# EAGLE design DC_Sensor_ESP8266_ADC_NC_11b (EAGLE 7.5.0)
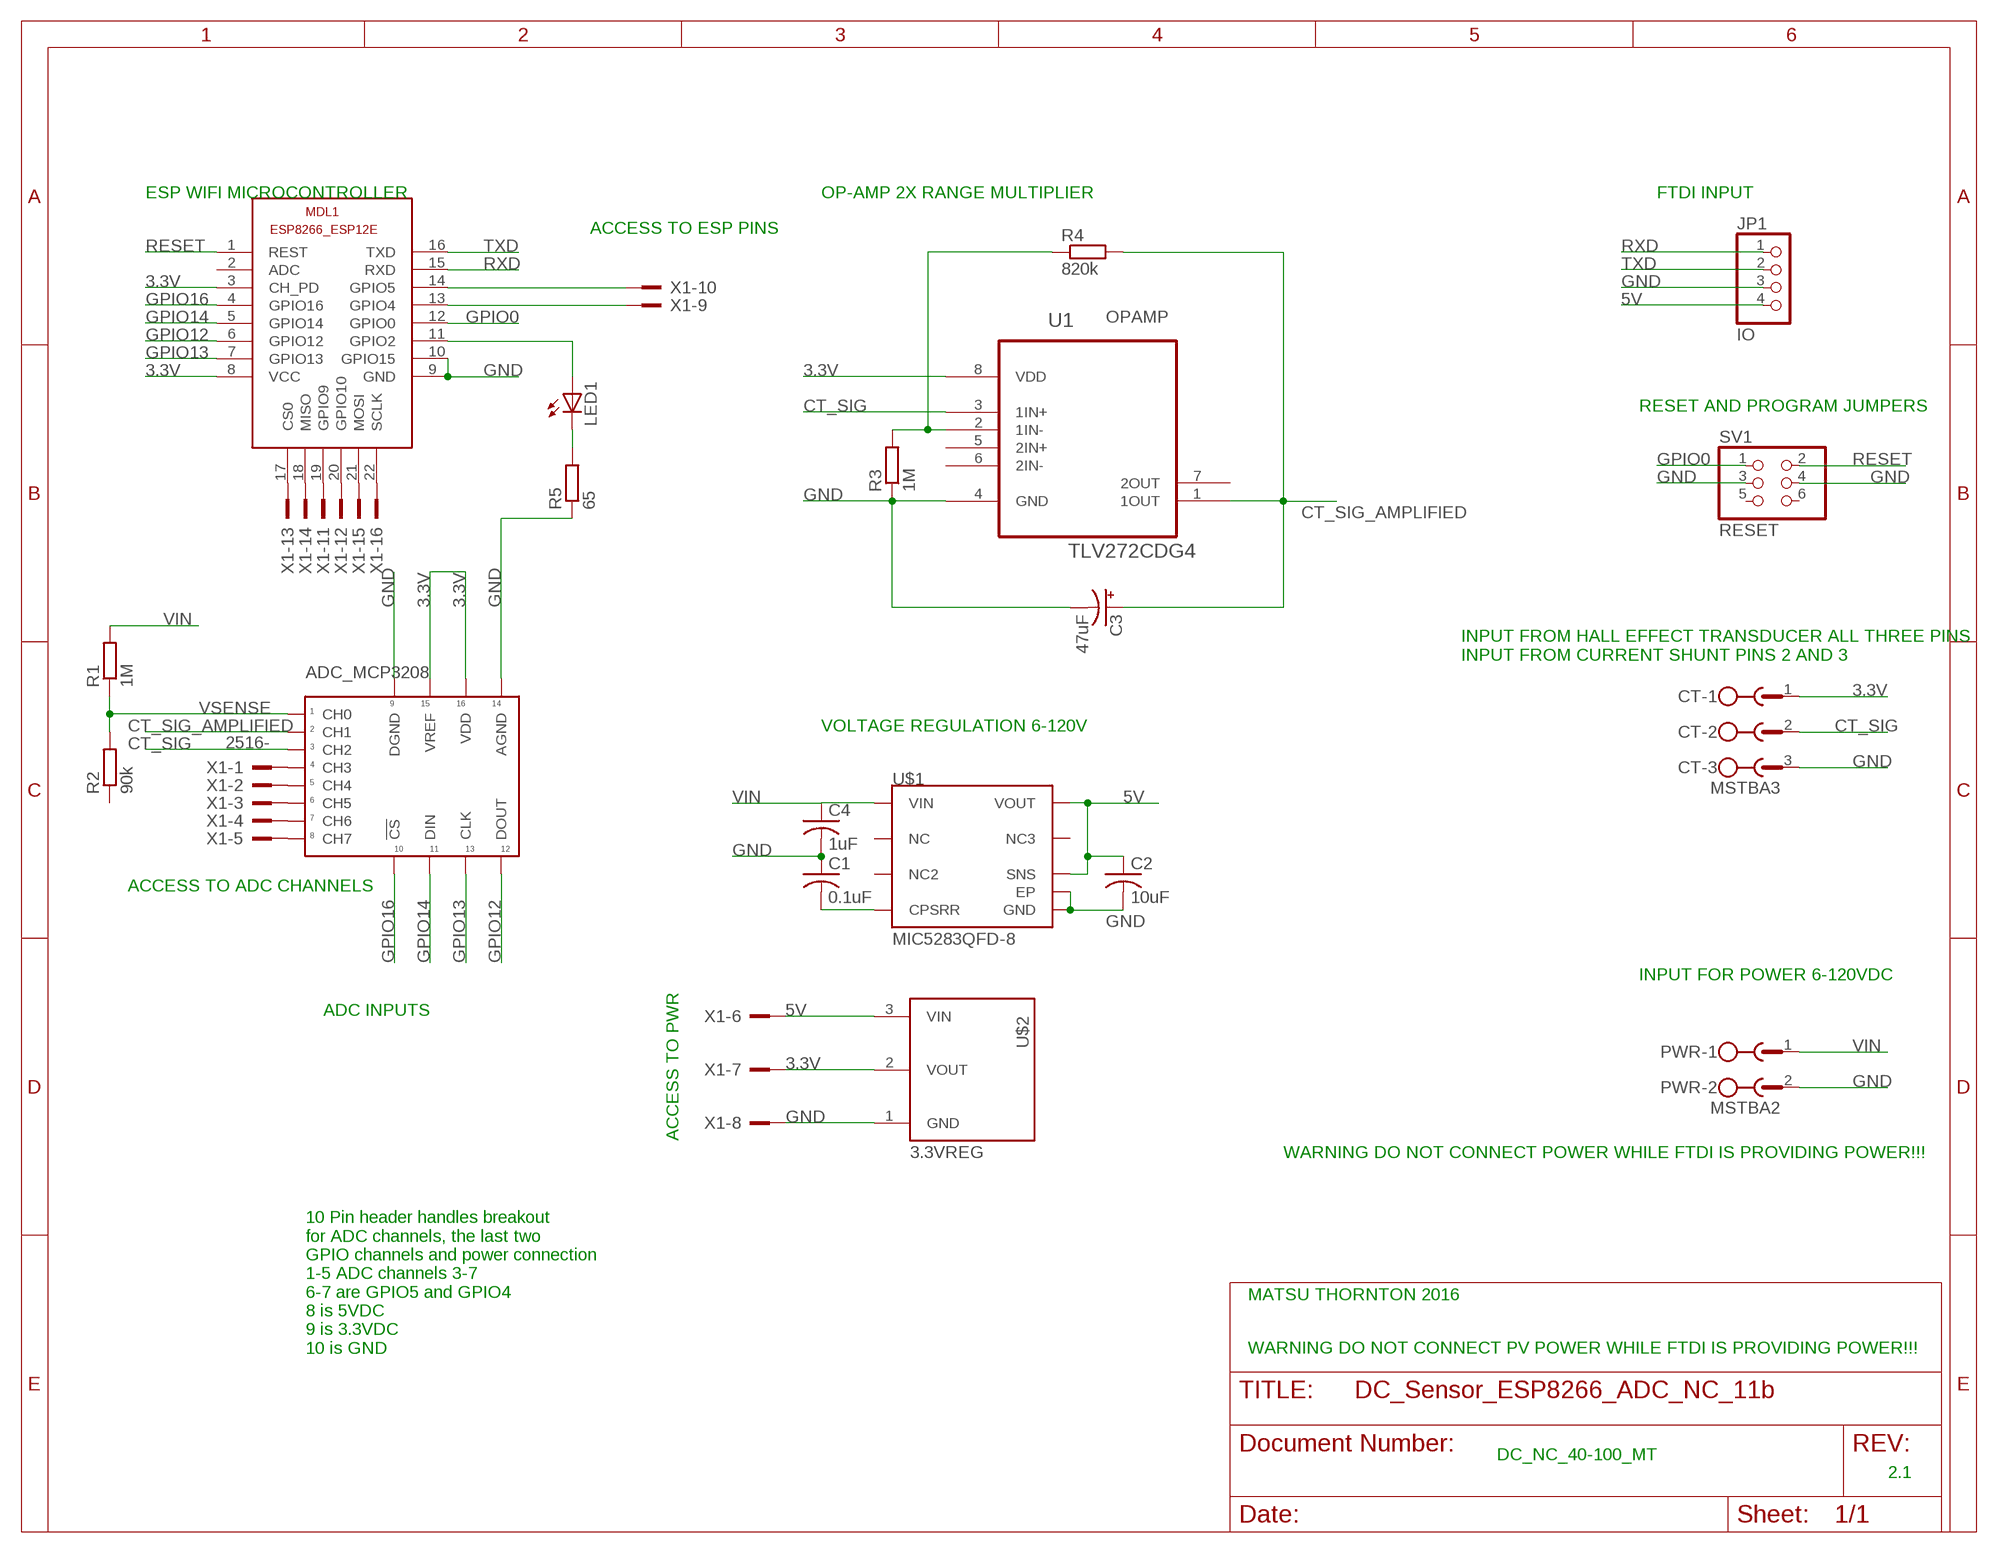
[diagram p0: schematic, sheet 1]

## Parts
ADC_MCP3208  21298ESMD  [PDIP16]
C1  0.1uF  C-USC0402  [C0402]
C2  10uF  C-USC0603K  [C0603K]
C3  47uF  CPOL-USC  [PANASONIC_C]
C4  1uF  C-USC2220K  [C2220K]
CT  MSTBA3  [MSTBA3]
JP1  IO  PINHD-1X4  [1X04]
LED1  LEDCHIP-LED0603  [CHIP-LED0603]
MDL1  ESP8266-12EESP8266-ESP12E  [ESP8266-ESP12E]
PWR  MSTBA2  [MSTBA2]
R1  1M  R-EU_R0805  [R0805]
R2  90k  R-EU_R0805  [R0805]
R3  1M  R-EU_R0805  [R0805]
R4  820k  R-EU_R0805  [R0805]
R5  65  R-EU_R0805  [R0805]
SV1  RESET  PINHD-2X3  [2X03]
U1  TLV272CDG4  [SOIC127P600X175-8N]
U$1  MIC5283QFD-8  [8-VDFN]
U$2  3.3VREG  [3PVREG]
X1  2516-  [PAK100/2500-16]

## Nets
3.3V: ADC_MCP3208.P$15(VREF) ADC_MCP3208.P$16(VDD) CT.1 MDL1.3(CH_PD) MDL1.8(VCC) U1.8(VDD) U$2.2(VOUT) X1.7
5V: C2.1 JP1.4 U$1.P$6(SNS) U$1.P$8(VOUT) U$2.3(VIN) X1.6
CT_SIG: ADC_MCP3208.P$3(CH2) CT.2 U1.3(1IN+)
CT_SIG_AMPLIFIED: ADC_MCP3208.P$2(CH1) C3.+ R4.2 U1.1(1OUT)
GND: ADC_MCP3208.P$9(DGND) ADC_MCP3208.P$14(AGND) C1.1 C2.2 C3.- C4.2 CT.3 JP1.3 MDL1.9(GND) MDL1.10(GPIO15) PWR.2 R3.1 R5.1 SV1.3 SV1.4 U1.4(GND) U$1.EXP(EP) U$1.P$5(GND) U$2.1(GND) X1.8
GPIO0: MDL1.12(GPIO0) SV1.1
GPIO4: MDL1.13(GPIO4) X1.9
GPIO5: MDL1.14(GPIO5) X1.10
GPIO12: ADC_MCP3208.P$12(DOUT) MDL1.6(GPIO12)
GPIO13: ADC_MCP3208.P$13(CLK) MDL1.7(GPIO13)
GPIO14: ADC_MCP3208.P$11(DIN) MDL1.5(GPIO14)
GPIO16: ADC_MCP3208.P$10(!CS) MDL1.4(GPIO16)
N$1: LED1.A MDL1.11(GPIO2)
N$2: R3.2 R4.1 U1.2(1IN-)
N$3: LED1.C R5.2
N$4: C1.2 U$1.P$4(CPSRR)
N$7: ADC_MCP3208.P$4(CH3) X1.1
N$8: ADC_MCP3208.P$5(CH4) X1.2
N$9: ADC_MCP3208.P$6(CH5) X1.3
N$10: ADC_MCP3208.P$7(CH6) X1.4
N$11: ADC_MCP3208.P$8(CH7) X1.5
N$12: MDL1.19(GPIO9) X1.11
N$13: MDL1.20(GPIO10) X1.12
N$14: MDL1.17(CS0) X1.13
N$15: MDL1.18(MISO) X1.14
N$16: MDL1.21(MOSI) X1.15
N$17: MDL1.22(SCLK) X1.16
RESET: MDL1.1(REST) SV1.2
RXD: JP1.1 MDL1.15(RXD)
TXD: JP1.2 MDL1.16(TXD)
VIN: C4.1 PWR.1 R1.2 U$1.P$1(VIN)
VSENSE: ADC_MCP3208.P$1(CH0) R1.1 R2.2
Unconnected: MDL1.2(ADC) R2.1 SV1.5 SV1.6 U1.5(2IN+) U1.6(2IN-) U1.7(2OUT) U$1.P$2(NC) U$1.P$3(NC2) U$1.P$7(NC3)

## Notes on the sheet
- ESP WIFI MICROCONTROLLER | OP-AMP 2X RANGE MULTIPLIER | FTDI INPUT
- ACCESS TO ESP PINS
- RESET AND PROGRAM JUMPERS
- INPUT FROM HALL EFFECT TRANSDUCER ALL THREE PINS
  INPUT FROM CURRENT SHUNT PINS 2 AND 3
- VOLTAGE REGULATION 6-120V
- ACCESS TO ADC CHANNELS
- INPUT FOR POWER 6-120VDC
- ADC INPUTS
- ACCESS TO PWR
- WARNING DO NOT CONNECT POWER WHILE FTDI IS PROVIDING POWER!!!
- MATSU THORNTON 2016
- 10 Pin header handles breakout 
  for ADC channels, the last two 
  GPIO channels and power connection
  1-5 ADC channels 3-7
  6-7 are GPIO5 and GPIO4
  8 is 5VDC
  9 is 3.3VDC
  10 is GND
- WARNING DO NOT CONNECT PV POWER WHILE FTDI IS PROVIDING POWER!!!
- DC_NC_40-100_MT
- 2.1

## Library data of the parts
ADC_MCP3208 = MCP3208:21298E
C1 = rcl:C-US: CAPACITOR, American symbol; MFG#: GRM155R71C104KA88J
C2 = rcl:C-US: CAPACITOR, American symbol
C3 = rcl:CPOL-US: POLARIZED CAPACITOR, American symbol
C4 = rcl:C-US: CAPACITOR, American symbol; MFG#: C5750X7R2E105M230KA
CT = con-phoenix-508:MSTBA3: PHOENIX; MF: FARNELL; MPN: 1757255; OC_FARNELL: 3705183; OC_NEWARK: 71C4162
JP1 = pinhead:PINHD-1X4: PIN HEADER
LED1 = led:LED: LED OSRAM: - CHIPLED LG R971, LG N971, LY N971, LG Q971, LY Q971, LO R971, LY R971 LH N974, LH R974 LS Q976, LO Q976, LY Q976 LO Q996 - Hyper CHIPLED LW Q18S LB Q993, LB Q99A, LB R99A - SideLED LS A670, LO A670, LY A670, LG A670, LP A670 LB A673, LV A673, LT A673, LW A673 LH A674 LY A675 LS A676, LA A676, LO A676, LY A676, LW A676 LS A679, LY A679, LG A679 - Hyper Micro SIDELED® LS Y876, LA Y876, LO Y876, LY Y876 LT Y87S - SmartLED LW L88C, LW L88S LB L89C, LB L89S, LG L890 LS L89K, LO L89K, LY L89K LS L896, LA L896, LO L896, LY L896 - TOPLED LS T670, LO T670, LY T670, LG T670, LP T670 LSG T670, LSP T670, LSY T670, LOP T670, LYG T670 LG T671, LOG T671, LSG T671 LB T673, LV T673, LT T673, LW T673 LH T674 LS T676, LA T676, LO T676, LY T676, LB T676, LH T676, LSB T676, LW T676 LB T67C, LV T67C, LT T67C, LS T67K, LO T67K, LY T67K, LW E67C LS E67B, LA E67B, LO E67B, LY E67B, LB E67C, LV E67C, LT E67C LW T67C LS T679, LY T679, LG T679 LS T770, LO T770, LY T770, LG T770, LP T770 LB T773, LV T773, LT T773, LW T773 LH T774 LS E675, LA E675, LY E675, LS T675 LS T776, LA T776, LO T776, LY T776, LB T776 LHGB T686 LT T68C, LB T68C - Hyper Mini TOPLED® LB M676 - Mini TOPLED Santana® LG M470 LS M47K, LO M47K, LY M47K Source: http://www.osram.convergy.de LUXEON: - LUMILED® LXK2-PW12-R00, LXK2-PW12-S00, LXK2-PW14-U00, LXK2-PW14-V00 LXK2-PM12-R00, LXK2-PM12-S00, LXK2-PM14-U00 LXK2-PE12-Q00, LXK2-PE12-R00, LXK2-PE12-S00, LXK2-PE14-T00, LXK2-PE14-U00 LXK2-PB12-K00, LXK2-PB12-L00, LXK2-PB12-M00, LXK2-PB14-N00, LXK2-PB14-P00, LXK2-PB14-Q00 LXK2-PR12-L00, LXK2-PR12-M00, LXK2-PR14-Q00, LXK2-PR14-R00 LXK2-PD12-Q00, LXK2-PD12-R00, LXK2-PD12-S00 LXK2-PH12-R00, LXK2-PH12-S00 LXK2-PL12-P00, LXK2-PL12-Q00, LXK2-PL12-R00 Source: www.luxeon.com KINGBRIGHT: KA-3528ASYC Source: www.kingbright.com
MDL1 = ESP8266-ESP12E:ESP8266-12E: ESP8266-12E with additional I/O and GPIO04/05 corrected The author cannot warrant that this library is free from error or will meet your specific requirements. Created by PuceBaboon.com. Komagane, Nagano, JAPAN
PWR = con-phoenix-508:MSTBA2: PHOENIX; MF: FARNELL; MPN: 1757242; OC_FARNELL: 3705171; OC_NEWARK: 71C4161
R1-R5 = rcl:R-EU_: RESISTOR, European symbol
SV1 = pinhead:PINHD-2X3: PIN HEADER
U1 = Texas Instruments_By_element14_Batch_1:TLV272CDG4: OPERATIONAL AMPLIFIERS; MPN: TLV272CDG4; OC_FARNELL: 1234856; OC_NEWARK: 13M5572; PACKAGE: SOIC-8; SUPPLIER: TI; TYPE: OPAMP
U$1 = vreg:MIC5283: MIC5283 Linear Voltage Regulators 120V/150mA Low PSSR Linear Regulator
U$2 = vreg2:3.3VREG: This is the standard type of 3.3V regulator that Holm and I have been using. It has three pins vin, vout, and ground with standard pin header spacing.
X1 = con-3m:2516-: 3M (TM) Pak 100 4-Wall Header Source: 3M; OC_FARNELL: unknown; OC_NEWARK: unknown

## Board
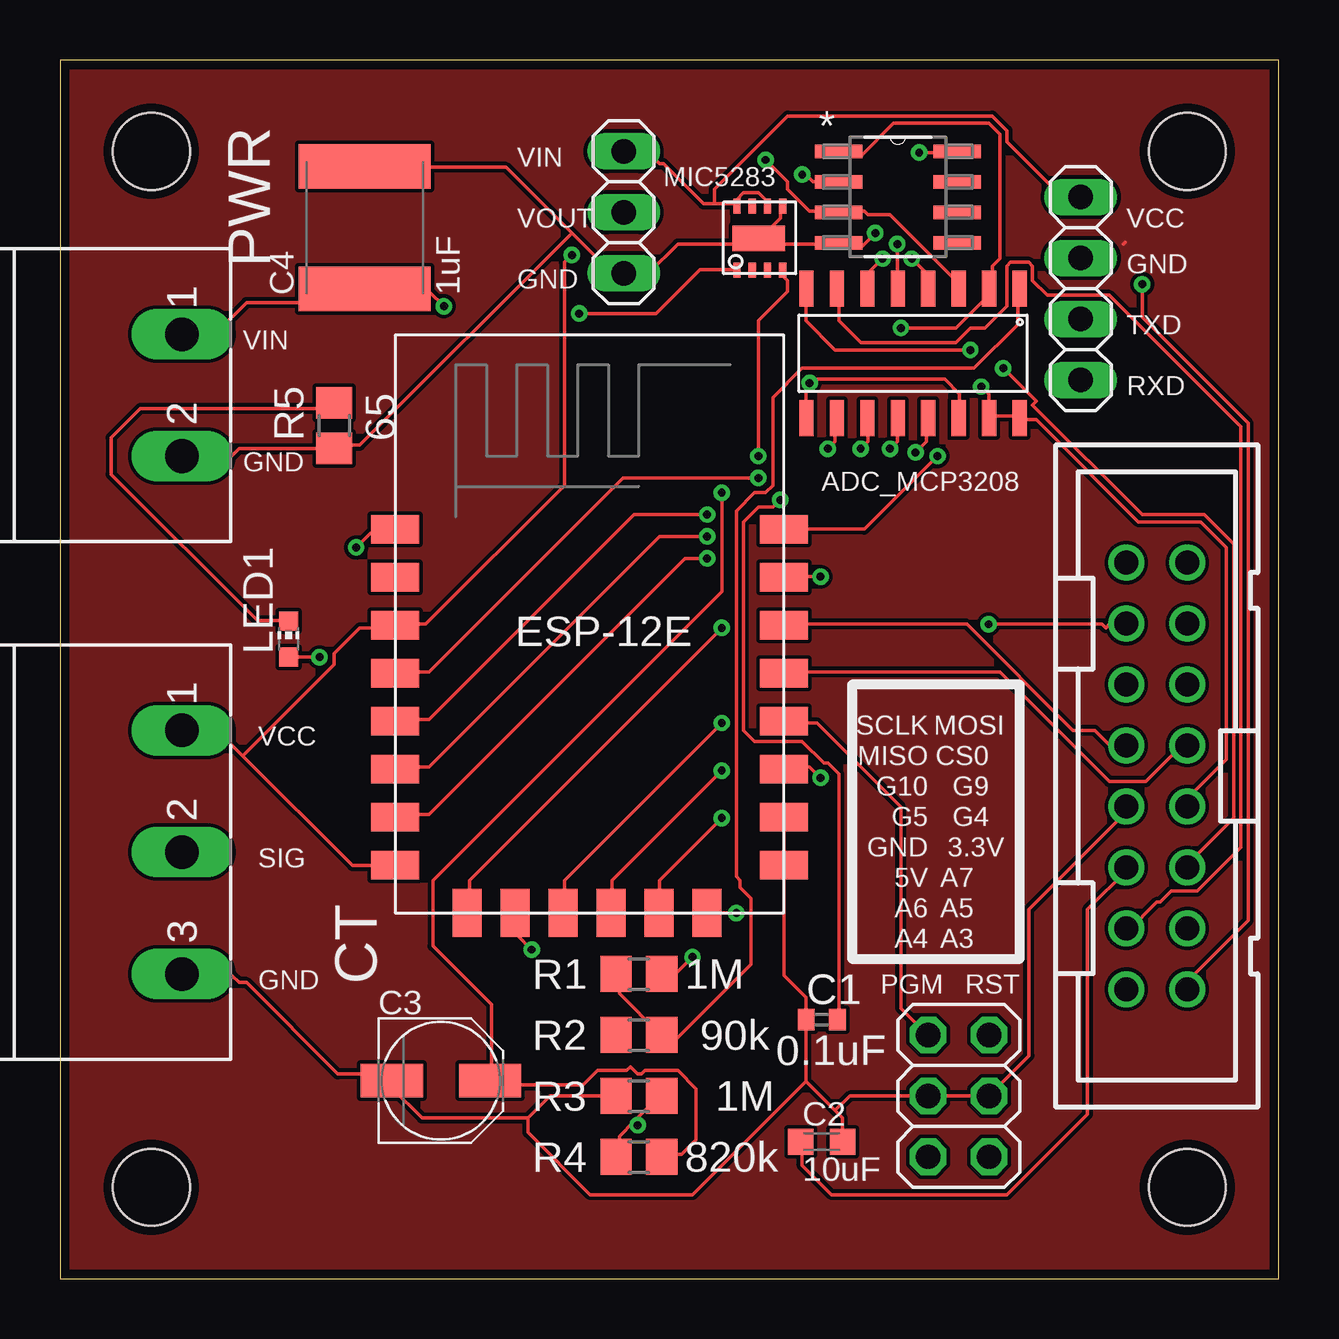
[diagram p1: board, top side]
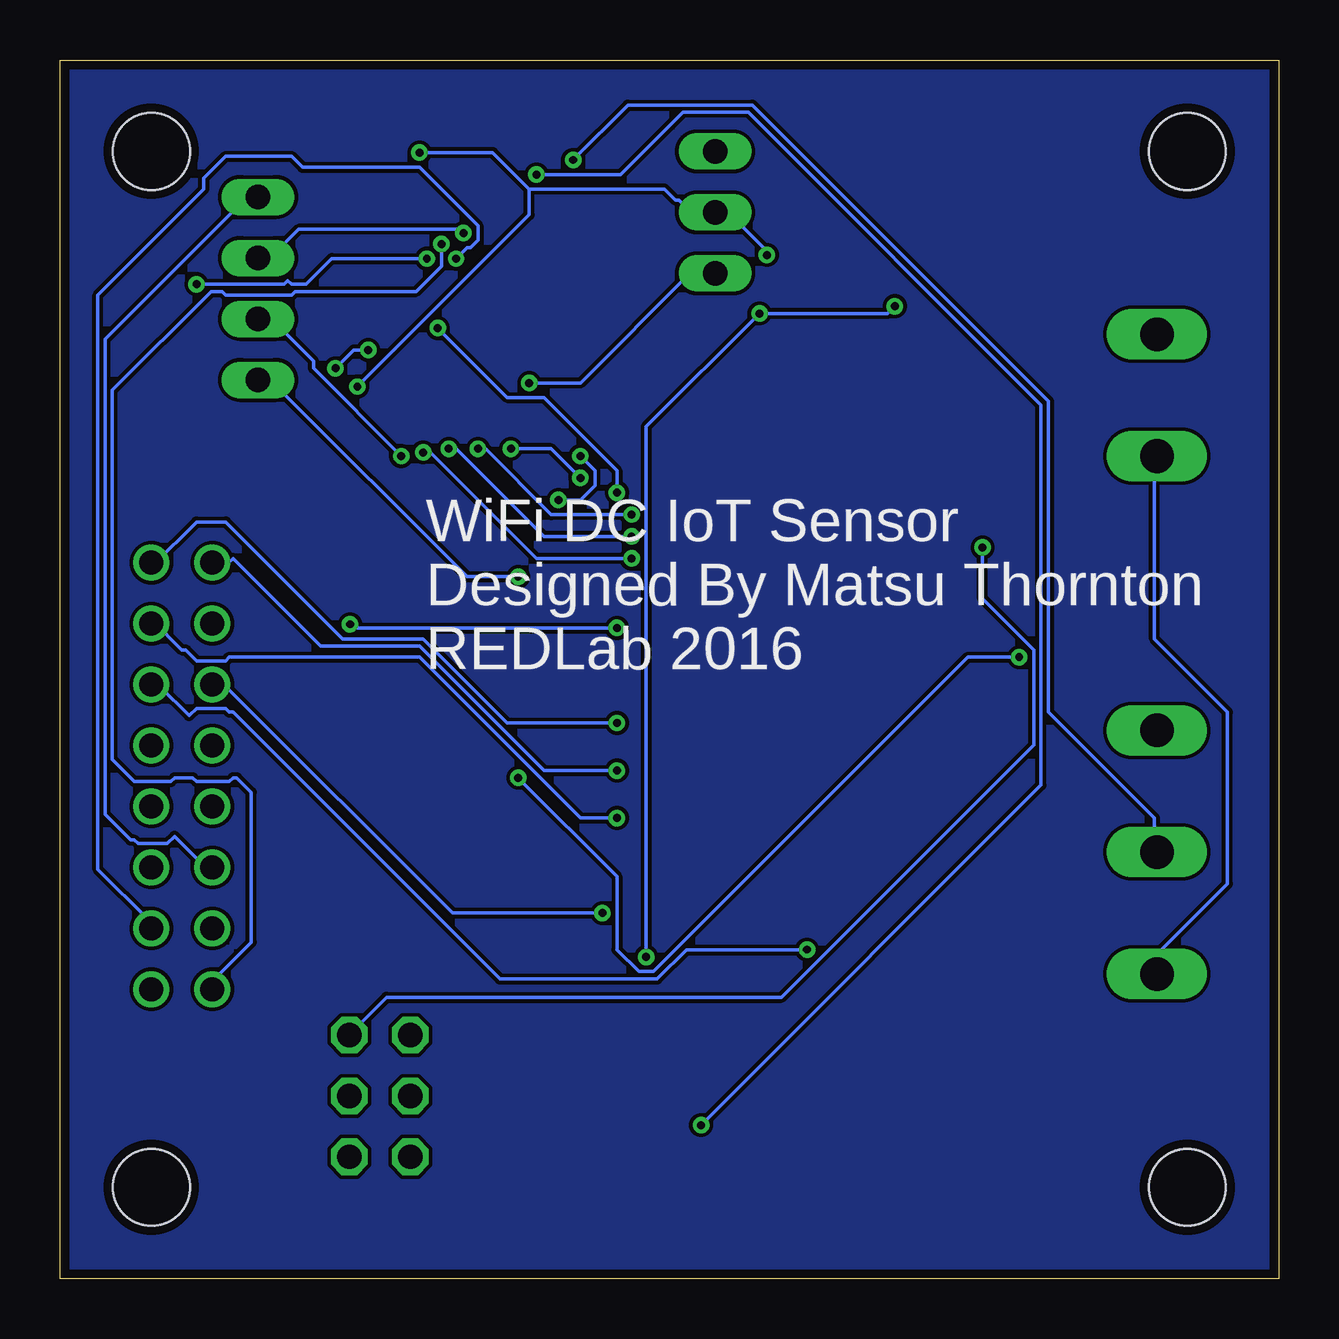
[diagram p2: board, bottom side, seen from below]

Size 50.8 x 50.8 mm. Coordinates in mm from the lower left corner, seen from the top.
Outline: 0,0 50.8,0 50.8,50.8 0,50.8 0,0
Copper layers (1*16): Top 0.0356mm / dielectric 1.5011mm / Bottom 0.0356mm
Design rules "LaenPCBOrder": minimum track width 6mil, minimum drill 13mil, track to track 6mil, track to pad 6mil, pad to pad 6mil, via to via 6mil, smd to smd 6mil, copper to edge 15mil, drill to drill 6mil, minimum pad ring 7mil, minimum via ring 7mil, stop-mask expansion 3mil, vias tented up to drill 0mil, thermal gap 10mil
Holes 3.2 mm at 3.81,46.99 46.99,46.99 46.99,3.81 3.81,3.81

### Footprints (pad centres in the part's own frame; a part is rotated, then mirrored left to right if it is on the bottom)
PDIP16 = smd 0.6 x 1.5: P$1 0,0; P$2 1.27,0; P$3 2.54,0; P$4 3.81,0; P$5 5.08,0; P$6 6.35,0; P$7 7.62,0; P$8 8.89,0; P$9 8.89,5.4; P$10 7.62,5.4; P$11 6.35,5.4; P$12 5.08,5.4; P$13 3.81,5.4; P$14 2.54,5.4; P$15 1.27,5.4; P$16 0,5.4
C0402 = smd 0.7 x 0.9: 1 -0.65,0; 2 0.65,0
C0603K = smd 1.05 x 1.08: 1 -0.875,0; 2 0.875,0
PANASONIC_C = smd 2.6 x 1.4: + 2.05,0; - -2.05,0
C2220K = smd 1.85 x 5.5: 1 -2.55,0; 2 2.55,0
MSTBA3 = drill 1.397 long: 1 -5.08,5.08; 2 0,5.08; 3 5.08,5.08
1X04 = drill 1.016 long: 1 -3.81,0; 2 -1.27,0; 3 1.27,0; 4 3.81,0
CHIP-LED0603 = smd 0.8 x 0.8: A 0,-0.75; C 0,0.75
ESP8266-ESP12E = smd 2 x 1.2: 1 0,16; 2 0,14; 3 0,12; 4 0,10; 5 0,8; 6 0,6; 7 0,4; 8 0,2; 9 16.2,2; 10 16.2,4; 11 16.2,6; 12 16.2,8; 13 16.2,10; 14 16.2,12; 15 16.2,14; 16 16.2,16 | smd 1.2 x 2: 17 11,0; 18 3,0; 19 5,0; 20 13,0; 21 7,0; 22 9,0
MSTBA2 = drill 1.397 long: 1 -2.54,5.08; 2 2.54,5.08
R0805 = smd 1.3 x 1.5: 1 -0.95,0; 2 0.95,0
2X03 = drill 1.016 octagon: 1 -2.54,-1.27; 2 -2.54,1.27; 3 0,-1.27; 4 0,1.27; 5 2.54,-1.27; 6 2.54,1.27
SOIC127P600X175-8N = smd 1.981 x 0.559: 1 -2.464,1.905; 2 -2.464,0.635; 3 -2.464,-0.635; 4 -2.464,-1.905; 5 2.464,-1.905; 6 2.464,-0.635; 7 2.464,0.635; 8 2.464,1.905
8-VDFN = smd 2.184 x 1.067: EXP 1.194,1.448 | smd 0.305 x 0.61: P$1 0.279,0.127; P$2 0.914,0.127; P$3 1.549,0.127; P$4 2.184,0.127; P$5 2.184,2.794; P$6 1.549,2.794; P$7 0.914,2.794; P$8 0.279,2.794
3PVREG = drill 1.016 long: 1 -2.54,0; 2 0,0; 3 2.54,0
PAK100/2500-16 = drill 1 pad 1.422: 1 -8.89,-1.27; 2 -8.89,1.27; 3 -6.35,-1.27; 4 -6.35,1.27; 5 -3.81,-1.27; 6 -3.81,1.27; 7 -1.27,-1.27; 8 -1.27,1.27; 9 1.27,-1.27; 10 1.27,1.27; 11 3.81,-1.27; 12 3.81,1.27; 13 6.35,-1.27; 14 6.35,1.27; 15 8.89,-1.27; 16 8.89,1.27

### Placement (x,y rotation side)
ADC_MCP3208  40.01,41.27 180 top
C1  31.75,10.79 0 top
C2  31.75,5.71 0 top
C3  15.88,8.26 0 top
C4  12.7,43.81 90 top
CT  0,17.78 270 top
JP1  42.55,41.27 90 top
LED1  9.53,26.67 0 top
MDL1  13.97,15.24 0 top
PWR  0,36.83 270 top
R1  24.13,12.7 0 top
R2  24.13,10.16 0 top
R3  24.13,7.62 0 top
R4  24.13,5.08 0 top
R5  11.43,35.56 90 top
SV1  37.47,7.62 270 top
U1  34.92,45.09 0 top
U$1  27.94,41.91 0 top
U$2  23.5,44.45 90 top
X1  45.72,20.95 90 top

### Tracks (layer width: path | path; a pad name or v marks a point on that pad's centre or on a via)
3.3V  (via drill 0.33)
  Top 0.152: 7.62,21.79 6.55,22.86 CT.1 | 7.62,21.79 12.19,17.22 13.87,17.22 MDL1.8 | 7.62,21.79 11.43,25.6 11.43,26.06 12.5,27.13 13.87,27.13 MDL1.3 14.02,27.28 15.24,27.28 21.03,33.07 21.03,42.37 v21.34,42.67 | v35.81,46.94 37.34,46.94 U1.8 | X1.7 47.09,19.81 47.09,20.12 48.62,21.64 48.62,30.48 47.55,31.55 44.96,31.55 40.69,35.81 40.08,35.81 ADC_MCP3208.P$16 39.93,35.97 38.86,35.97 ADC_MCP3208.P$15 38.71,35.97 38.71,36.88 v38.41,37.19
  Bottom 0.152: v35.81,46.94 32.77,46.94 31.24,45.41 | 31.24,45.41 25.6,45.41 25.15,44.96 24.99,44.96 24.54,44.5 23.62,44.5 U$2.2 23.47,44.35 22.86,44.35 21.34,42.82 v21.34,42.67 | 31.24,45.41 31.24,44.35 v38.41,37.19
5V
  Top 0.152: 28.19,44.81 28.19,44.96 28.5,45.26 29.11,45.26 29.57,44.81 U$1.P$6 | 27.28,44.81 26.82,44.81 25.15,46.48 24.99,46.48 24.54,46.94 23.62,46.94 U$2.3 | 27.28,44.81 28.19,44.81 | 28.19,44.81 U$1.P$8 | 27.28,44.81 27.28,45.41 30.33,48.46 38.86,48.46 39.47,47.85 39.47,47.4 41.76,45.11 42.52,45.11 JP1.4 | C2.1 30.94,5.64 30.94,4.72 32.16,3.5 39.47,3.5 42.82,6.86 42.82,15.39 44.5,17.07 X1.6
  Bottom 0.152: JP1.4 42.67,44.96 43.13,44.96 48.92,39.17 48.92,19.36 47.85,18.29 47.7,18.29 47.55,18.14 46.33,18.14 46.02,18.44 44.81,17.22 44.5,17.22 X1.6
CT_SIG  (via drill 0.33)
  Top 0.152: 32.46,44.5 33.53,44.5 33.68,44.35 34.59,44.35 37.34,41.6 37.34,41.3 ADC_MCP3208.P$3 | v29.41,46.63 30.33,45.72 30.33,45.41 31.24,44.5 32.46,44.5 | 32.46,44.5 U1.3
  Bottom 0.152: v29.41,46.63 27.13,48.92 21.95,48.92 9.6,36.58 9.6,23.62 5.18,19.2 5.18,17.83 CT.2
CT_SIG_AMPLIFIED  (via drill 0.33)
  Top 0.152: R4.2 25.15,5.18 25.91,5.18 26.52,5.79 26.52,7.92 25.76,8.69 24.38,8.69 24.23,8.53 24.08,8.53 23.77,8.84 23.62,8.69 22.4,8.69 21.79,8.08 18.14,8.08 17.98,8.23 C3.+ 17.98,8.38 17.98,11.43 15.54,13.87 15.54,16.61 27.58,28.65 v27.58,32.77 | U1.1 32.46,46.94 32.61,46.79 33.38,46.79 34.75,48.16 38.71,48.16 39.17,47.7 39.17,42.52 38.86,42.22 38.86,41.3 ADC_MCP3208.P$2 38.86,41.15 37.34,39.62 v35.05,39.62
  Bottom 0.152: v27.58,32.77 27.58,33.68 30.63,36.73 32.16,36.73 v35.05,39.62
GND  (via drill 0.33)
  Top 0.152: PWR.2 7.16,34.29 7.47,34.59 11.43,34.59 R5.1 11.43,34.75 12.5,34.75 21.34,43.59 | ADC_MCP3208.P$9 31.09,35.97 31.09,37.19 v31.24,37.34 31.39,37.49 36.88,37.49 37.49,36.88 37.49,35.97 ADC_MCP3208.P$14 | 29.57,43.74 29.26,43.43 U$1.EXP | 29.57,43.74 30.02,44.2 30.02,44.65 U$1.P$5 | 32.46,43.13 30.18,43.13 29.57,43.74 | 29.57,43.74 U$1.EXP | U$1.EXP 29.11,43.28 28.96,43.13 25.76,43.13 24.54,41.91 U$2.1 23.01,41.91 21.34,43.59 | v33.98,43.59 33.38,42.98 32.61,42.98 32.46,43.13 | 32.46,43.13 U1.4 | 21.34,43.59 18.59,46.33 12.8,46.33 C4.2 | R3.1 20.42,7.62 19.51,6.71 | 19.51,6.71 15.09,6.71 13.87,7.92 13.87,8.23 C3.- 13.72,8.38 13.56,8.53 11.58,8.53 7.77,12.34 7.47,12.34 7.16,12.65 5.18,12.65 CT.3 | MDL1.10 30.18,19.2 30.18,17.37 MDL1.9 30.18,17.22 30.18,12.65 31.09,11.73 31.09,10.82 C1.1 31.09,10.67 31.09,8.23 | 32.31,7.01 32.61,6.71 32.61,5.79 C2.2 | 32.31,7.01 31.09,8.23 | 38.71,7.62 40.39,9.3 40.39,15.39 44.35,19.36 44.35,19.66 X1.8 | 38.71,7.62 SV1.3 32.92,7.62 32.31,7.01 | 38.71,7.62 SV1.4 | 19.51,6.71 19.51,6.1 22.1,3.5 26.36,3.5 31.09,8.23
  Bottom 0.152: v33.98,43.59 34.14,43.74 40.84,43.74 41.91,42.67 42.52,42.67 JP1.3 | v31.24,37.34 29.11,37.34 24.54,41.91 U$2.1 | PWR.2 5.18,34.29 5.18,26.67 2.13,23.62 2.13,16.46 5.03,13.56 5.03,12.8 CT.3
GPIO0
  Top 0.152: MDL1.12 30.18,23.16 31.55,23.16 35.05,19.66 35.05,11.28 36.12,10.21 SV1.1
GPIO4
  Top 0.152: MDL1.13 30.18,25.3 39.17,25.3 43.74,20.73 45.26,20.73 46.63,22.1 46.94,22.1 X1.9
GPIO5
  Top 0.152: MDL1.14 30.18,27.28 37.8,27.28 42.22,22.86 43.13,22.86 43.74,22.25 44.35,22.25 X1.10
GPIO12  (via drill 0.33)
  Top 0.152: v34.59,34.59 34.9,34.9 34.9,35.81 ADC_MCP3208.P$12 | v26.98,30.94 24.99,30.94 15.39,21.34 14.02,21.34 MDL1.6
  Bottom 0.152: v34.59,34.59 34.29,34.59 30.63,30.94 v26.98,30.94
GPIO13  (via drill 0.33)
  Top 0.152: v35.66,34.44 36.12,34.9 36.12,35.81 ADC_MCP3208.P$13 | v26.98,30.02 26.06,30.02 15.39,19.36 14.02,19.36 MDL1.7
  Bottom 0.152: v35.66,34.44 35.36,34.44 30.94,30.02 v26.98,30.02
GPIO14  (via drill 0.33)
  Top 0.152: v33.38,34.59 33.68,34.9 33.68,35.81 ADC_MCP3208.P$11 | v26.98,31.85 23.93,31.85 15.39,23.32 14.02,23.32 MDL1.5
  Bottom 0.152: v33.38,34.59 33.07,34.59 30.33,31.85 v26.98,31.85
GPIO16  (via drill 0.33)
  Top 0.152: v32,34.59 32.31,34.9 32.31,35.81 ADC_MCP3208.P$10 | v29.11,33.38 23.47,33.38 15.39,25.3 14.02,25.3 MDL1.4
  Bottom 0.152: v32,34.59 30.33,34.59 v29.11,33.38
N$1  (via drill 0.33)
  Top 0.152: v10.82,25.91 9.6,25.91 LED1.A | v31.7,20.88 31.24,21.34 30.18,21.34 MDL1.11
  Bottom 0.152: v10.82,25.91 12.95,25.91 26.06,12.8 26.67,12.8 27.58,13.72 27.58,16.76 v31.7,20.88
N$2  (via drill 0.33)
  Top 0.152: 23.93,6.55 24.99,7.62 R3.2 | 23.93,6.55 23.32,5.94 23.32,5.18 R4.1 | U1.2 31.39,45.72 31.24,45.87 31.09,45.87 v30.94,46.02 | 23.93,6.55 v24.08,6.4
  Bottom 0.152: v30.94,46.02 27.43,46.02 24.84,48.62 22.1,48.62 9.91,36.42 9.91,20.57 v24.08,6.4
N$3
  Top 0.152: LED1.C 9.45,27.43 8.23,27.43 2.13,33.53 2.13,35.05 3.35,36.27 11.28,36.27 11.43,36.42 R5.2
N$4  (via drill 0.33)
  Top 0.152: v29.11,34.29 29.11,39.93 30.33,41.15 30.33,41.6 30.18,41.76 30.18,41.91 U$1.P$4 | v30.02,32.46 29.72,32.16 29.11,32.16 28.5,31.55 28.5,22.86 28.96,22.4 30.94,22.4 31.85,21.49 32,21.49 32.46,21.03 32.46,10.82 C1.2
  Bottom 0.152: v29.11,34.29 28.5,33.68 28.5,33.07 29.11,32.46 v30.02,32.46
N$5
  Top 0.152: 44.32,43.13 44.4,43.21
  pour Top: 0,50.8 50.8,50.8 50.8,0 0,0
N$6
  pour Bottom: 50.8,50.8 0,50.8 0,0 50.8,0
N$7  (via drill 0.33)
  Top 0.152: v35.51,42.52 36.12,41.91 36.12,41.3 ADC_MCP3208.P$4 | v45.11,41.45 45.11,40.08 49.53,35.66 49.53,14.94 47.09,12.5 47.09,12.19 X1.1
  Bottom 0.152: v35.51,42.52 39.47,42.52 40.54,41.45 41.15,41.45 41.3,41.6 41.45,41.45 v45.11,41.45
N$8  (via drill 0.33)
  Top 0.152: v34.9,43.13 34.9,41.3 ADC_MCP3208.P$5
  Bottom 0.152: v34.9,43.13 34.9,42.22 35.97,41.15 41,41.15 41.15,41 43.89,41 44.04,41.15 44.5,41.15 48.62,37.03 48.62,21.64 47.7,20.73 46.18,20.73 46.02,20.88 45.26,20.88 45.11,20.73 43.74,20.73 43.59,20.88 43.43,20.88 42.82,20.27 42.82,14.02 44.35,12.5 44.35,12.19 X1.2
N$9  (via drill 0.33)
  Top 0.152: v34.29,42.52 33.68,41.91 33.68,41.3 ADC_MCP3208.P$6
  Bottom 0.152: v34.29,42.52 33.83,42.98 33.68,42.98 33.38,43.28 33.38,43.89 35.81,46.33 40.69,46.33 41.15,46.79 43.89,46.79 44.81,45.87 44.81,45.41 49.23,41 49.23,17.07 47.09,14.94 47.09,14.63 X1.3
N$10
  Top 0.152: ADC_MCP3208.P$7 32.46,41.15 32.46,39.93 33.38,39.01 37.34,39.01 37.95,39.62 38.56,39.62 39.47,40.54 39.47,42.22 39.62,42.37 40.39,42.37 40.54,42.22 40.54,41.6 41.15,41 43.74,41 49.23,35.51 49.23,17.98 47.4,16.15 46.33,16.15 45.87,15.7 45.72,15.7 44.5,14.48 X1.4
N$11  (via drill 0.33)
  Top 0.152: v37.95,38.71 32.31,38.71 31.09,39.93 31.09,41.15 ADC_MCP3208.P$8 | v39.32,37.95 40.69,36.58 40.54,36.42 45.11,31.85 47.7,31.85 48.92,30.63 48.92,19.2 46.94,17.22 X1.5
  Bottom 0.152: v37.95,38.71 38.56,38.71 v39.32,37.95
N$12  (via drill 0.33)
  Top 0.152: v19.66,13.72 19.05,14.33 19.05,15.24 MDL1.19
  Bottom 0.152: v19.66,13.72 24.69,13.72 25.91,12.5 32.46,12.5 43.59,23.62 43.74,23.62 43.89,23.77 45.11,23.77 45.41,23.47 46.63,24.69 46.94,24.69 X1.11
N$13  (via drill 0.33)
  Top 0.152: v28.19,15.24 MDL1.20
  Bottom 0.152: v28.19,15.24 34.44,15.24 43.89,24.69 44.35,24.69 X1.12
N$14  (via drill 0.33)
  Top 0.152: v27.58,19.2 24.99,16.61 24.99,15.24 MDL1.17
  Bottom 0.152: v27.58,19.2 29.11,19.2 35.81,25.91 43.74,25.91 43.89,25.76 45.11,25.76 45.57,26.21 45.72,26.21 46.94,27.43 X1.13
N$15  (via drill 0.33)
  Top 0.152: v27.58,27.13 17.07,16.61 17.07,15.24 MDL1.18 | v38.71,27.28 43.43,27.28 43.59,27.13 43.74,27.28 44.35,27.28 X1.14
  Bottom 0.152: v27.58,27.13 38.56,27.13 v38.71,27.28
N$16  (via drill 0.33)
  Top 0.152: v27.58,23.16 21.03,16.61 21.03,15.24 MDL1.21
  Bottom 0.152: v27.58,23.16 32.16,23.16 35.66,26.67 39.01,26.67 43.89,31.55 45.11,31.55 46.94,29.72 X1.15
N$17  (via drill 0.33)
  Top 0.152: v27.58,21.18 23.01,16.61 23.01,15.24 MDL1.22
  Bottom 0.152: v27.58,21.18 30.63,21.18 35.81,26.36 39.93,26.36 43.59,30.02 43.74,29.87 44.35,29.87 X1.16
RESET  (via drill 0.33)
  Top 0.152: v12.34,30.48 12.95,31.09 13.87,31.09 MDL1.1
  Bottom 0.152: v12.34,30.48 12.34,28.35 10.21,26.21 10.21,22.25 20.73,11.73 37.19,11.73 38.71,10.21 SV1.2
RXD  (via drill 0.33)
  Top 0.152: v31.7,29.26 30.18,29.26 MDL1.15
  Bottom 0.152: v31.7,29.26 33.83,29.26 41.91,37.34 42.52,37.34 JP1.1
TXD  (via drill 0.33)
  Top 0.152: v36.58,34.29 33.53,31.24 MDL1.16
  Bottom 0.152: v36.58,34.29 40.23,37.95 40.23,38.25 41.91,39.93 42.52,39.93 JP1.2
VIN  (via drill 0.33)
  Top 0.152: v21.64,40.23 24.84,40.23 26.67,42.06 28.19,42.06 U$1.P$1 | v16,40.54 15.39,41.15 12.8,41.15 C4.1 12.65,41.15 12.19,40.69 7.77,40.69 6.55,39.47 5.18,39.47 PWR.1 | v26.36,13.41 25.76,12.8 25.15,12.8 R1.2
  Bottom 0.152: v16,40.54 16.31,40.23 v21.64,40.23 26.36,35.51 v26.36,13.41
VSENSE
  Top 0.152: R1.1 23.32,12.65 23.32,11.89 24.99,10.21 R2.2 25.15,10.06 25.76,10.06 28.8,13.11 28.8,15.85 28.35,16.31 28.35,16.61 28.19,16.76 28.19,32 28.96,32.77 29.41,32.77 29.72,33.07 29.72,36.73 30.94,37.95 38.1,37.95 39.93,39.78 39.93,41.15 ADC_MCP3208.P$1

### Text on the board
bPlace: WiFi DC IoT Sensor / Designed By Matsu Thornton / REDLab 2016
tNames: VIN | MIC5283 | VOUT | VCC | GND | GND | VIN | TXD | RXD | GND | SCLK | MOSI | VCC | MISO | CS0 | G10 | G9 | G5 | G4 | GND | 3.3V | SIG | 5V | A7 | A6 | A5 | A4 | A3 | PGM | RST | GND